# Altium schematic sheet 电剪_V1.0.SchDoc
size A3
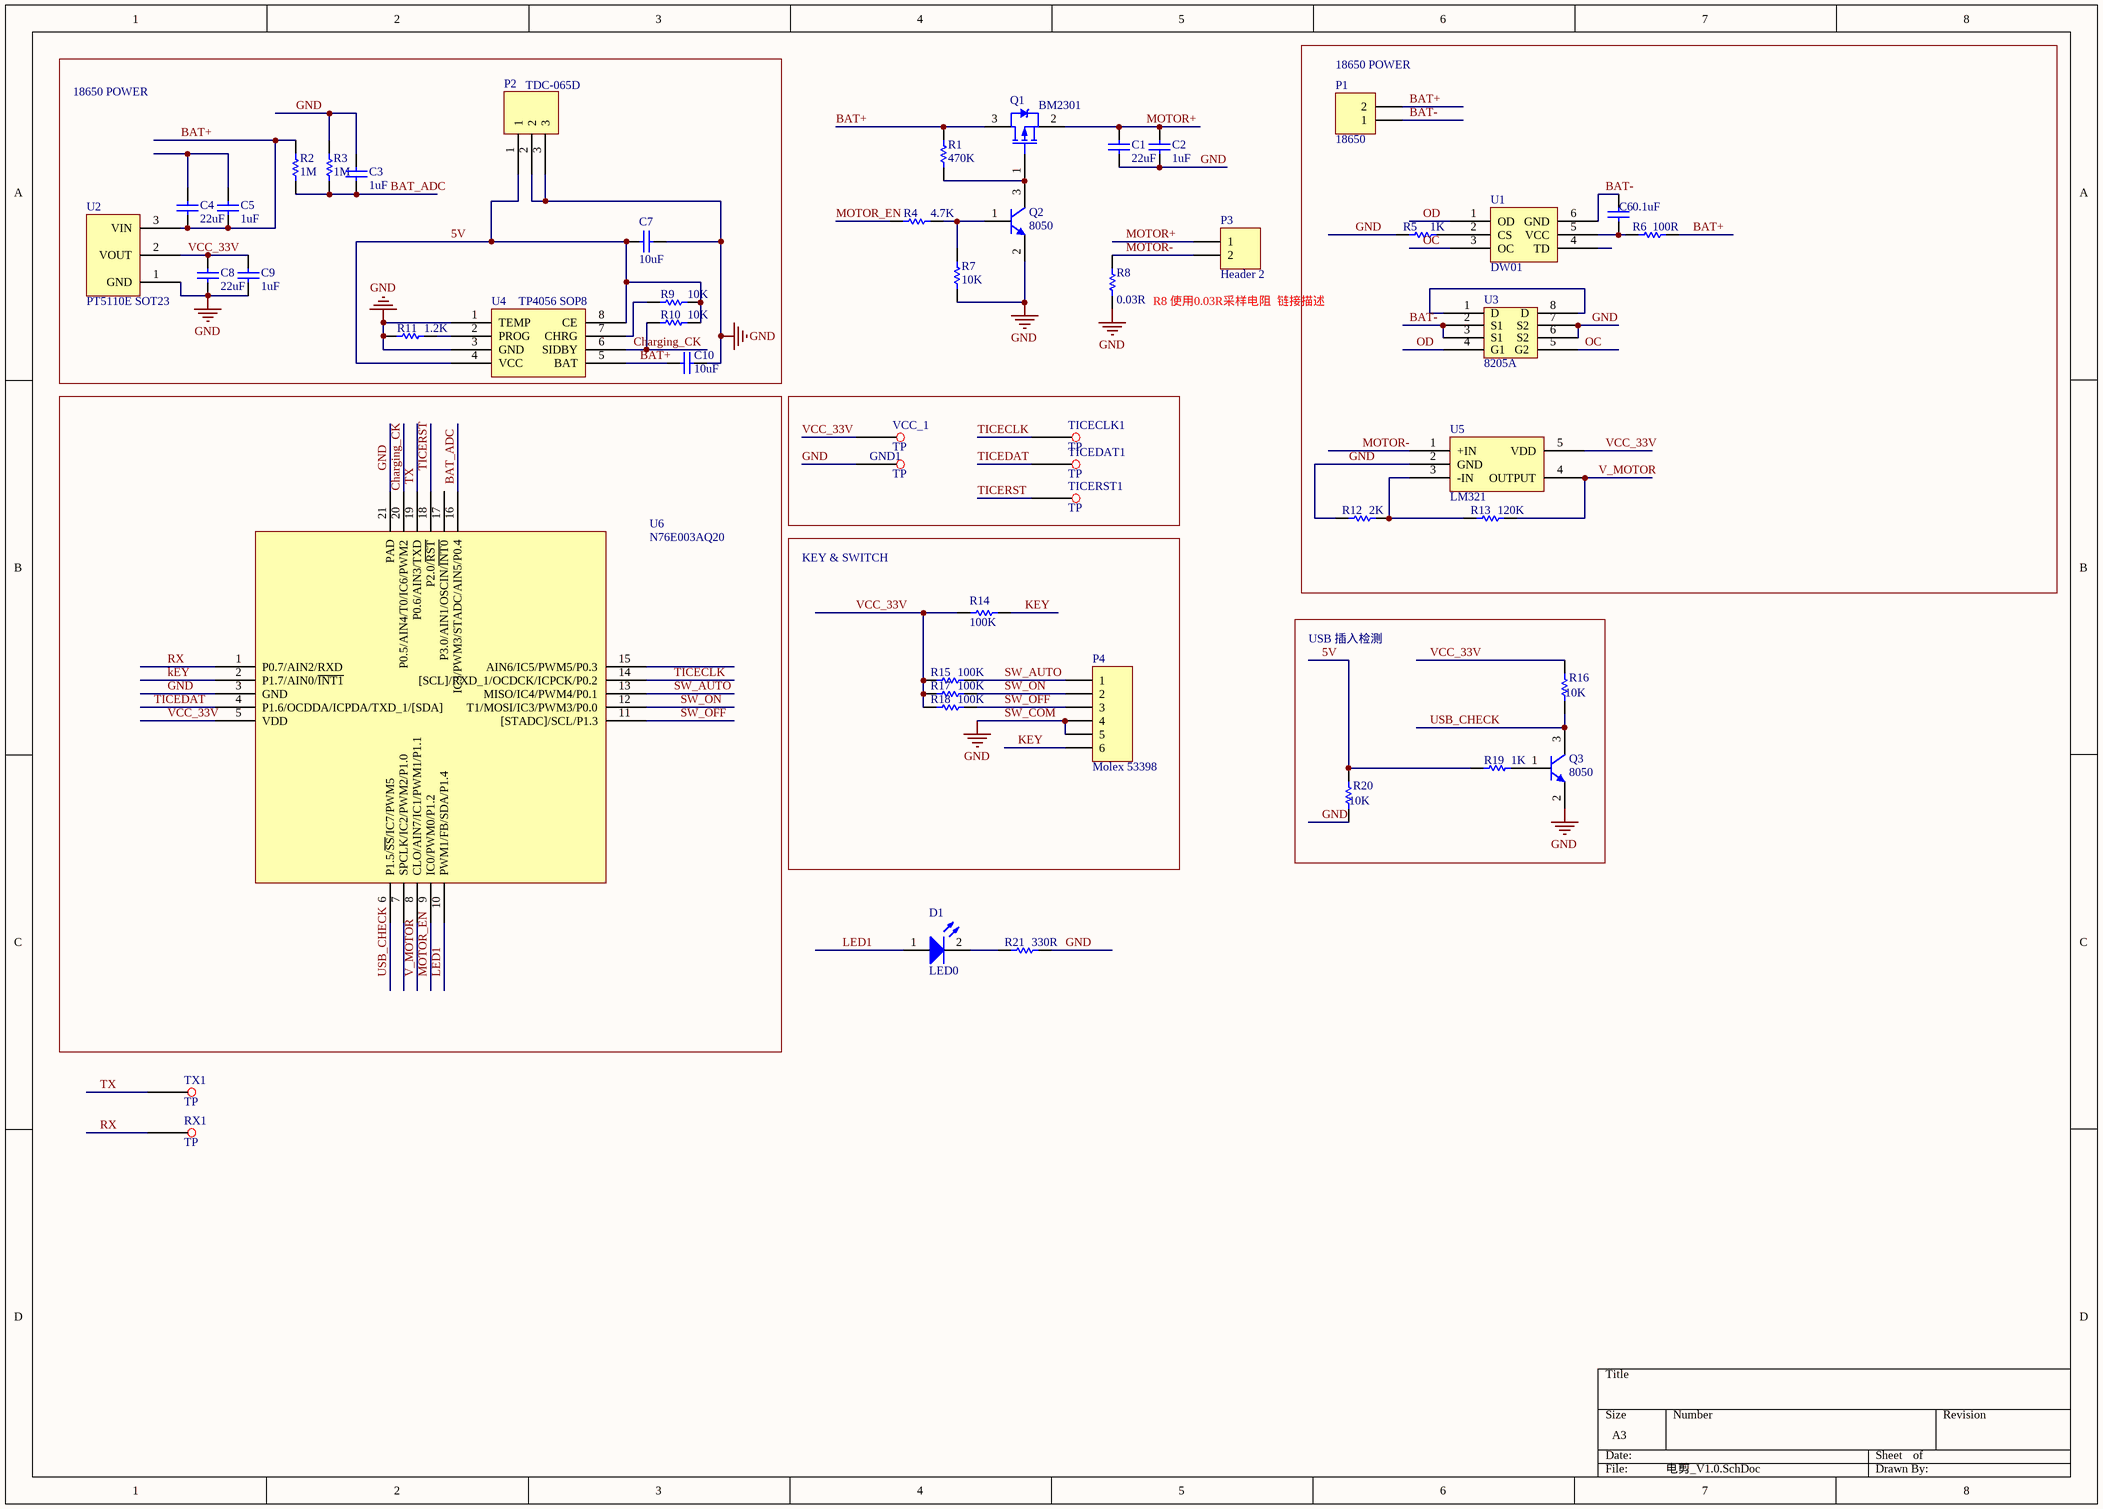
[diagram p0: 电剪_V1.0.SchDoc]

## Parts
C1  22uF  [C-0805]
C2  1uF  [C-0603]
C3  1uF  [C-0603]
C4  22uF  [C-0805]
C5  1uF  [C-0603]
C6  0.1uF  [C-0603]
C7  10uF  [C-0805]
C8  22uF  [C-0805]
C9  1uF  [C-0603]
C10  10uF  [C-0805]
D1  LED0  [LED-0603]
GND1  TP  [TP-1.2]
P1  18650  [HDR1X2]
P2  TDC-065D  [TDC-065D]
P3  Header 2  [HDR1X2]
P4  Molex 53398  [Molex 53398]
Q1  BM2301  [SOT-23]
Q2  8050  [SOT-23]
Q3  8050  [SOT-23]
R1  470K  [R-0603]
R2  1M  [R-0603]
R3  1M  [R-0603]
R4  4.7K  [R-0603]
R5  1K  [R-0603]
R6  100R  [R-0603]
R7  10K  [R-0603]
R8  0.03R  [R-0805]
R9  10K  [R-0603]
R10  10K  [R-0603]
R11  1.2K  [R-0603]
R12  2K  [R-0603]
R13  120K  [R-0603]
R14  100K  [R-0603]
R15  100K  [R-0603]
R16  10K  [R-0603]
R17  100K  [R-0603]
R18  100K  [R-0603]
R19  1K  [R-0603]
R20  10K  [R-0603]
R21  330R  [R-0603]
RX1  TP  [TP-1.2]
TICECLK1  TP  [TP-1.2]
TICEDAT1  TP  [TP-1.2]
TICERST1  TP  [TP-1.2]
TX1  TP  [TP-1.2]
U1  DW01  [SOT-23-6L]
U2  PT5110E SOT23  [SOT-23]
U3  8205A  [TSSOP-8]
U4  TP4056 SOP8  [ESOP8]
U5  LM321  [SOT-23-5]
U6  N76E003AQ20  [QFN-20 0.4mm]
VCC_1  TP  [TP-1.2]

## Blocks framed on the sheet
18650 POWER: C3-C5 C7-C10 P2 R2 R3 R9-R11 U2 U4
18650 POWER: C6 P1 R5 R6 R12 R13 U1 U3 U5
KEY & SWITCH: P4 R14 R15 R17 R18
USB 插入检测: Q3 R16 R19 R20

## Nets
GND: C1.1 C2.1 C3.2 C7.2 C8.1 C9.1 C10.2 GND1.1 P2.2 P2.3 P4.4 P4.5 Q2.2(E) Q3.2(E) R3.1 R5.2 R7.1 R8.1 R11.1 R12.2 R20.2 R21.1 U2.1(GND) U3.6(S2) U3.7(S2) U4.1(TEMP) U4.3(GND) U5.2(GND) U6.3(GND) U6.21(PAD)  [also labelled SW_COM]
5V: C7.1 P2.1 R9.2 R10.2 R19.1 R20.1 U4.4(VCC) U4.8(CE)
BAT+: C4.1 C5.1 C10.1 P1.2 Q1.3(D) R1.2 R2.1 R6.1 U2.3(VIN) U4.5(BAT)
BAT-: C6.2 P1.1 U1.6(GND) U3.2(S1) U3.3(S1)
BAT_ADC: C3.1 R2.2 R3.2 U6.16(IC3/PWM3/STADC/AIN5/P0.4)
Charging_CK: R10.1 U4.6(SIDBY) U6.20(P0.5/AIN4/T0/IC6/PWM2)
kEY: P4.6 R14.2 U6.2(P1.7/AIN0/~{INT1})
LED1: D1.1(A) U6.10(PWM1/FB/SDA/P1.4)
MOTOR+: C1.2 C2.2 P3.1 Q1.2(S)
MOTOR-: P3.2 R8.2 U5.1(+IN)
MOTOR_EN: R4.1 U6.9(IC0/PWM0/P1.2)
OC: U1.3(OC) U3.5(G2)
OD: U1.1(OD) U3.4(G1)
RX: RX1.1 U6.1(P0.7/AIN2/RXD)
SW_AUTO: P4.1 R15.2 U6.13(MISO/IC4/PWM4/P0.1)
SW_OFF: P4.3 R18.2 U6.11([STADC]/SCL/P1.3)
SW_ON: P4.2 R17.2 U6.12(T1/MOSI/IC3/PWM3/P0.0)
TICECLK: TICECLK1.1 U6.14([SCL]/RXD_1/OCDCK/ICPCK/P0.2)
TICEDAT: TICEDAT1.1 U6.4(P1.6/OCDDA/ICPDA/TXD_1/[SDA])
TICERST: TICERST1.1 U6.18(P2.0/~{RST})
TX: TX1.1 U6.19(P0.6/AIN3/TXD)
USB_CHECK: Q3.3(C) R16.1 U6.6(P1.5/~{SS}/IC7/PWM5)
V_MOTOR: R13.1 U5.4(OUTPUT) U6.8(CLO/AIN7/IC1/PWM1/P1.1)
VCC_33V: C8.2 C9.2 R14.1 R15.1 R16.2 R17.1 R18.1 U2.2(VOUT) U5.5(VDD) U6.5(VDD) VCC_1.1
NetC4_2: C4.2 C5.2
NetC6_1: C6.1 R6.2 U1.5(VCC)
NetD1_2: D1.2(K) R21.2
NetQ1_1: Q1.1(G) Q2.3(C) R1.1
NetQ2_1: Q2.1(B) R4.2 R7.2
NetQ3_1: Q3.1(B) R19.2
NetR5_1: R5.1 U1.2(CS)
NetR9_1: R9.1 U4.7(CHRG)
NetR11_2: R11.2 U4.2(PROG)
NetR12_1: R12.1 R13.2 U5.3(-IN)
NetU3_1: U3.1(D) U3.8(D)

Not connected (* = marked no-connect by the designer): U1 4(TD); U6 7(SPCLK/IC2/PWM2/P1.0) 15(AIN6/IC5/PWM5/P0.3) 17(P3.0/AIN1/OSCIN/~{INT0})

## Notes on the sheet
- R8 使用0.03R采样电阻  链接描述

## Library data of the parts
C1-C10 = Cap: Capacitor; Published: 8-Jun-2000; LatestRevisionDate: 17-Jul-2002; LatestRevisionNote: Re-released for DXP Platform.; PackageReference: RAD-0.3; Publisher: Altium Limited; PackageDescription: Radial Cap, Thru-Hole; 2 Leads; 0.3 in Pin Spacing
D1 = LED0: Typical INFRARED GaAs LED; Published: 8-Jun-2000; LatestRevisionDate: 08-Jul-2005; LatestRevisionNote: Mech Layer 1 removed.; PackageReference: LED-0; Publisher: Altium Limited
P1 P3 = Header 2: Header, 2-Pin; LatestRevisionDate: 17-Jul-2002; LatestRevisionNote: Re-released for DXP Platform.; Publisher: Altium Limited
P4 = Header 6H: Header, 6-Pin, Right Angle; LatestRevisionDate: 17-Jul-2002; LatestRevisionNote: Re-released for DXP Platform.; Publisher: Altium Limited
Q1 = PMOS-2: P-Channel Power MOSFET; Note: Pin 4 not drawn and electrically connected to Pin 2.; Published: 8-Jun-2000; LatestRevisionDate: 17-Jul-2002; LatestRevisionNote: Re-released for DXP Platform.; DatasheetVersion: PD-9.390D; PackageReference: TO-220AB; Publisher: Altium Limited; Code_JEDEC: TO-220-AB; ComponentLink1Description: Manufacturer Link; ComponentLink1URL: http://www.irf.com/
Q2 Q3 = NPN: NPN Bipolar Transistor; Published: 8-Jun-2000; LatestRevisionDate: 17-Jul-2002; LatestRevisionNote: Re-released for DXP Platform.; PackageReference: TO-226-AA; Publisher: Altium Limited; PackageDescription: TO, Flat Index; 3 In-Line, Axial Leads; Body Dia. 4.8mm; Leads 0.55 x 0.51 mm (max); Code_JEDEC: TO-226-AA
R1-R7 R9-R21 = Res1: Resistor; Published: 8-Jun-2000; LatestRevisionDate: 17-Jul-2002; LatestRevisionNote: Re-released for DXP Platform.; PackageReference: AXIAL-0.3; Publisher: Altium Limited
  R1-R7 R9-R19 R21: PackageDescription: Axial Device, Thru-Hole; 2 Leads; 0.3 in Pin Spacing
  R20: Value: 10K
R8 = Res1: Published: 8-Jun-2000; LatestRevisionDate: 17-Jul-2002; LatestRevisionNote: Re-released for DXP Platform.; PackageReference: AXIAL-0.3; Publisher: Altium Limited; Value: 0.03R; link: https://detail.1688.com/offer/576589924224.html?spm=a312h.2018_new_sem.dh_002.41.148d17c3GYqES5